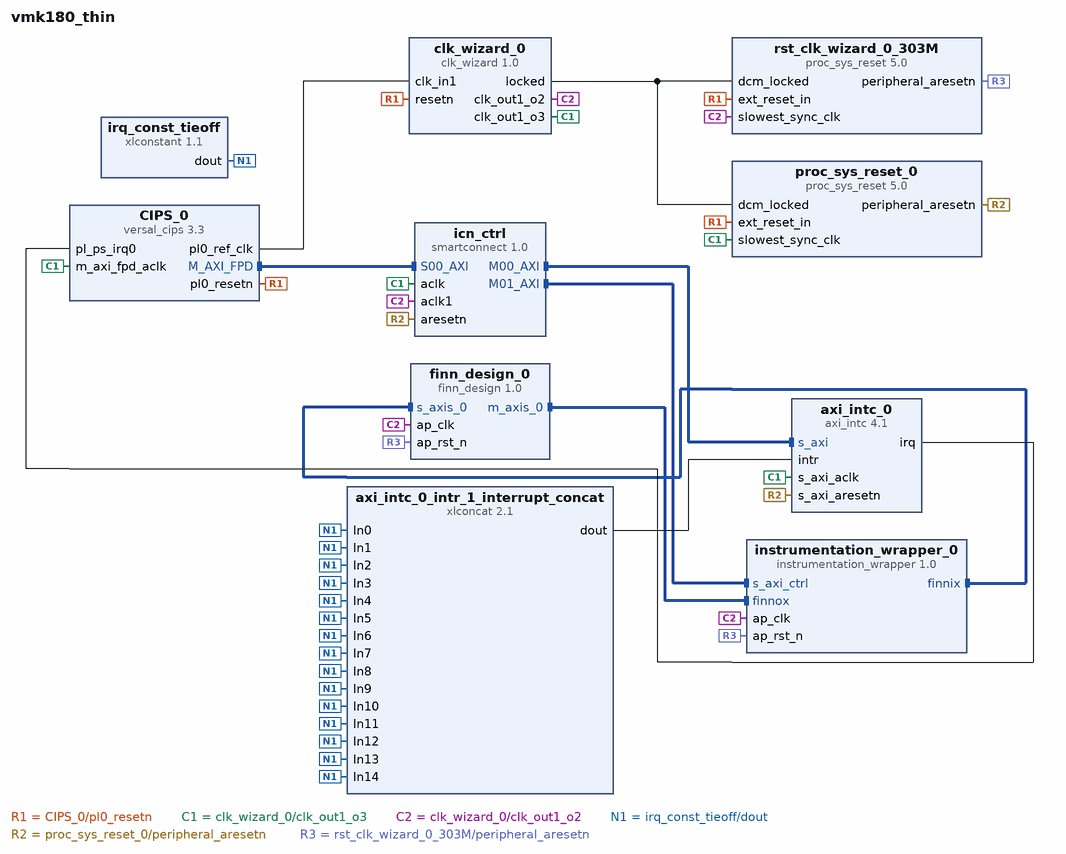
[diagram p0: block diagram of the top level]
# Vivado block design vmk180_thin, xcvm1802-vsva2197-2MP-e-S, Vivado 2022.2
create_bd_design vmk180_thin

create_bd_cell -type ip -vlnv xilinx.com:ip:versal_cips:3.3 CIPS_0
set_property -dict [list \
  CONFIG.CLOCK_MODE Custom \
  CONFIG.DDR_MEMORY_MODE Custom \
  CONFIG.PS_BOARD_INTERFACE ps_pmc_fixed_io \
  CONFIG.PS_PL_CONNECTIVITY_MODE Custom \
  CONFIG.PS_PMC_CONFIG {['CLOCK_MODE Custom', 'DDR_MEMORY_MODE Custom', 'DESIGN_MODE 1', 'PMC_CRP_PL0_REF_CTRL_FREQMHZ 99.999992', 'PMC_GPIO0_MIO_PERIPHERAL {{ENABLE 1} {IO {PMC_MIO 0 .. 25}}}', 'PMC_GPIO1_MIO_PERIPHERAL {{ENABLE 1} {IO {PMC_MIO 26 .. 51}}}', 'PMC_MIO37 {{AUX_IO 0} {DIRECTION out} {DRIVE_STRENGTH 8mA} {OUTPUT_DATA high} {PULL pullup} {SCHMITT 0} {SLEW slow} {USAGE GPIO}}', 'PMC_OSPI_PERIPHERAL {{ENABLE 0} {IO {PMC_MIO 0 .. 11}} {MODE Single}}', 'PMC_QSPI_COHERENCY 0', 'PMC_QSPI_FBCLK {{ENABLE 1} {IO {PMC_MIO 6}}}', 'PMC_QSPI_PERIPHERAL_DATA_MODE x4', 'PMC_QSPI_PERIPHERAL_ENABLE 1', 'PMC_QSPI_PERIPHERAL_MODE {Dual Parallel}', 'PMC_REF_CLK_FREQMHZ 33.3333', 'PMC_SD1 {{CD_ENABLE 1} {CD_IO {PMC_MIO 28}} {POW_ENABLE 1} {POW_IO {PMC_MIO 51}} {RESET_ENABLE 0} {RESET_IO {PMC_MIO 12}} {WP_ENABLE 0} {WP_IO {PMC_MIO 1}}}', 'PMC_SD1_COHERENCY 0', 'PMC_SD1_DATA_TRANSFER_MODE 8Bit', 'PMC_SD1_PERIPHERAL {{CLK_100_SDR_OTAP_DLY 0x3} {CLK_200_SDR_OTAP_DLY 0x2} {CLK_50_DDR_ITAP_DLY 0x36} {CLK_50_DDR_OTAP_DLY 0x3} {CLK_50_SDR_ITAP_DLY 0x2C} {CLK_50_SDR_OTAP_DLY 0x4} {ENABLE 1} {IO {PMC_MIO 26 .. 36}}}', 'PMC_SD1_SLOT_TYPE {SD 3.0}', 'PMC_USE_PMC_NOC_AXI0 0', 'PS_BOARD_INTERFACE ps_pmc_fixed_io', 'PS_CAN1_PERIPHERAL {{ENABLE 1} {IO {PMC_MIO 40 .. 41}}}', 'PS_ENET0_MDIO {{ENABLE 1} {IO {PS_MIO 24 .. 25}}}', 'PS_ENET0_PERIPHERAL {{ENABLE 1} {IO {PS_MIO 0 .. 11}}}', 'PS_ENET1_PERIPHERAL {{ENABLE 1} {IO {PS_MIO 12 .. 23}}}', 'PS_GEN_IPI0_ENABLE 1', 'PS_GEN_IPI0_MASTER A72', 'PS_GEN_IPI1_ENABLE 1', 'PS_GEN_IPI1_MASTER A72', 'PS_GEN_IPI2_ENABLE 1', 'PS_GEN_IPI2_MASTER A72', 'PS_GEN_IPI3_ENABLE 1', 'PS_GEN_IPI3_MASTER A72', 'PS_GEN_IPI4_ENABLE 1', 'PS_GEN_IPI4_MASTER A72', 'PS_GEN_IPI5_ENABLE 1', 'PS_GEN_IPI5_MASTER A72', 'PS_GEN_IPI6_ENABLE 1', 'PS_GEN_IPI6_MASTER A72', 'PS_I2C0_PERIPHERAL {{ENABLE 1} {IO {PMC_MIO 46 .. 47}}}', 'PS_I2C1_PERIPHERAL {{ENABLE 1} {IO {PMC_MIO 44 .. 45}}}', 'PS_IRQ_USAGE {{CH0 1} {CH1 0} {CH10 0} {CH11 0} {CH12 0} {CH13 0} {CH14 0} {CH15 0} {CH2 0} {CH3 0} {CH4 0} {CH5 0} {CH6 0} {CH7 0} {CH8 0} {CH9 0}}', 'PS_MIO19 {{AUX_IO 0} {DIRECTION in} {DRIVE_STRENGTH 8mA} {OUTPUT_DATA default} {PULL disable} {SCHMITT 0} {SLEW slow} {USAGE Reserved}}', 'PS_MIO21 {{AUX_IO 0} {DIRECTION in} {DRIVE_STRENGTH 8mA} {OUTPUT_DATA default} {PULL disable} {SCHMITT 0} {SLEW slow} {USAGE Reserved}}', 'PS_MIO7 {{AUX_IO 0} {DIRECTION in} {DRIVE_STRENGTH 8mA} {OUTPUT_DATA default} {PULL disable} {SCHMITT 0} {SLEW slow} {USAGE Reserved}}', 'PS_MIO9 {{AUX_IO 0} {DIRECTION in} {DRIVE_STRENGTH 8mA} {OUTPUT_DATA default} {PULL disable} {SCHMITT 0} {SLEW slow} {USAGE Reserved}}', 'PS_NUM_FABRIC_RESETS 1', 'PS_PCIE_EP_RESET1_IO None', 'PS_PCIE_EP_RESET2_IO None', 'PS_PCIE_RESET {{ENABLE 1}}', 'PS_PL_CONNECTIVITY_MODE Custom', 'PS_TTC0_PERIPHERAL_ENABLE 1', 'PS_UART0_PERIPHERAL {{ENABLE 1} {IO {PMC_MIO 42 .. 43}}}', 'PS_USB3_PERIPHERAL {{ENABLE 1} {IO {PMC_MIO 13 .. 25}}}', 'PS_USE_FPD_AXI_NOC0 0', 'PS_USE_FPD_AXI_NOC1 0', 'PS_USE_FPD_CCI_NOC 0', 'PS_USE_M_AXI_FPD 1', 'PS_USE_NOC_LPD_AXI0 0', 'PS_USE_PMCPL_CLK0 1', 'SMON_ALARMS Set_Alarms_On', 'SMON_ENABLE_TEMP_AVERAGING 0', 'SMON_TEMP_AVERAGING_SAMPLES 0']} \
  CONFIG.PS_PMC_CONFIG_APPLIED 1 \
] [get_bd_cells CIPS_0]
create_bd_cell -type ip -vlnv xilinx.com:ip:axi_intc:4.1 axi_intc_0
set_property -dict {CONFIG.C_ASYNC_INTR 0xFFFFFFFF CONFIG.C_IRQ_CONNECTION 1} [get_bd_cells axi_intc_0]
create_bd_cell -type ip -vlnv xilinx.com:ip:clk_wizard:1.0 clk_wizard_0
set_property -dict [list \
  CONFIG.CE_TYPE HARDSYNC \
  CONFIG.CLKOUT_DRIVES MBUFGCE \
  CONFIG.CLKOUT_DYN_PS None \
  CONFIG.CLKOUT_GROUPING Auto \
  CONFIG.CLKOUT_MATCHED_ROUTING false \
  CONFIG.CLKOUT_PORT clk_out1 \
  CONFIG.CLKOUT_REQUESTED_DUTY_CYCLE 50.000 \
  CONFIG.CLKOUT_REQUESTED_OUT_FREQUENCY 606.0606060606061 \
  CONFIG.CLKOUT_REQUESTED_PHASE 0.000 \
  CONFIG.CLKOUT_USED true \
  CONFIG.JITTER_SEL Min_O_Jitter \
  CONFIG.PRIM_SOURCE No_buffer \
  CONFIG.RESET_TYPE ACTIVE_LOW \
  CONFIG.USE_PHASE_ALIGNMENT true \
] [get_bd_cells clk_wizard_0]
create_bd_cell -type ip -vlnv xilinx.com:ip:proc_sys_reset:5.0 proc_sys_reset_0
create_bd_cell -type ip -vlnv xilinx.com:ip:smartconnect:1.0 icn_ctrl
set_property -dict {CONFIG.NUM_CLKS 2 CONFIG.NUM_MI 2 CONFIG.NUM_SI 1} [get_bd_cells icn_ctrl]
create_bd_cell -type ip -vlnv xilinx_finn:finn:finn_design:1.0 finn_design_0
create_bd_cell -type ip -vlnv xilinx.com:hls:instrumentation_wrapper:1.0 instrumentation_wrapper_0
create_bd_cell -type ip -vlnv xilinx.com:ip:xlconcat:2.1 axi_intc_0_intr_1_interrupt_concat
set_property -dict {CONFIG.NUM_PORTS 15} [get_bd_cells axi_intc_0_intr_1_interrupt_concat]
create_bd_cell -type ip -vlnv xilinx.com:ip:xlconstant:1.1 irq_const_tieoff
set_property -dict {CONFIG.CONST_VAL 0 CONFIG.CONST_WIDTH 1} [get_bd_cells irq_const_tieoff]
create_bd_cell -type ip -vlnv xilinx.com:ip:proc_sys_reset:5.0 rst_clk_wizard_0_303M

# ---- connections ----

connect_bd_intf_net -intf_net CIPS_0_M_AXI_GP0 [get_bd_intf_pins CIPS_0/M_AXI_FPD] [get_bd_intf_pins icn_ctrl/S00_AXI]
connect_bd_intf_net [get_bd_intf_pins finn_design_0/m_axis_0] [get_bd_intf_pins instrumentation_wrapper_0/finnox]
connect_bd_intf_net [get_bd_intf_pins axi_intc_0/s_axi] [get_bd_intf_pins icn_ctrl/M00_AXI]
connect_bd_intf_net [get_bd_intf_pins icn_ctrl/M01_AXI] [get_bd_intf_pins instrumentation_wrapper_0/s_axi_ctrl]
connect_bd_intf_net [get_bd_intf_pins instrumentation_wrapper_0/finnix] [get_bd_intf_pins finn_design_0/s_axis_0]
connect_bd_net -net CIPS_0_pl_clk0 [get_bd_pins CIPS_0/pl0_ref_clk] [get_bd_pins clk_wizard_0/clk_in1]
connect_bd_net -net CIPS_0_pl_resetn1 [get_bd_pins CIPS_0/pl0_resetn] \
  [get_bd_pins clk_wizard_0/resetn] [get_bd_pins proc_sys_reset_0/ext_reset_in] \
  [get_bd_pins rst_clk_wizard_0_303M/ext_reset_in]
connect_bd_net [get_bd_pins axi_intc_0_intr_1_interrupt_concat/dout] [get_bd_pins axi_intc_0/intr]
connect_bd_net [get_bd_pins axi_intc_0/irq] [get_bd_pins CIPS_0/pl_ps_irq0]
connect_bd_net -net clk_wizard_0_clk_out1 [get_bd_pins clk_wizard_0/clk_out1_o3] \
  [get_bd_pins axi_intc_0/s_axi_aclk] [get_bd_pins CIPS_0/m_axi_fpd_aclk] [get_bd_pins icn_ctrl/aclk] \
  [get_bd_pins proc_sys_reset_0/slowest_sync_clk]
connect_bd_net [get_bd_pins clk_wizard_0/clk_out1_o2] \
  [get_bd_pins finn_design_0/ap_clk] [get_bd_pins instrumentation_wrapper_0/ap_clk] \
  [get_bd_pins rst_clk_wizard_0_303M/slowest_sync_clk] [get_bd_pins icn_ctrl/aclk1]
connect_bd_net [get_bd_pins clk_wizard_0/locked] [get_bd_pins proc_sys_reset_0/dcm_locked] [get_bd_pins rst_clk_wizard_0_303M/dcm_locked]
connect_bd_net [get_bd_pins irq_const_tieoff/dout] \
  [get_bd_pins axi_intc_0_intr_1_interrupt_concat/In1] [get_bd_pins axi_intc_0_intr_1_interrupt_concat/In0] \
  [get_bd_pins axi_intc_0_intr_1_interrupt_concat/In2] [get_bd_pins axi_intc_0_intr_1_interrupt_concat/In3] \
  [get_bd_pins axi_intc_0_intr_1_interrupt_concat/In4] [get_bd_pins axi_intc_0_intr_1_interrupt_concat/In5] \
  [get_bd_pins axi_intc_0_intr_1_interrupt_concat/In6] [get_bd_pins axi_intc_0_intr_1_interrupt_concat/In7] \
  [get_bd_pins axi_intc_0_intr_1_interrupt_concat/In8] [get_bd_pins axi_intc_0_intr_1_interrupt_concat/In9] \
  [get_bd_pins axi_intc_0_intr_1_interrupt_concat/In10] [get_bd_pins axi_intc_0_intr_1_interrupt_concat/In11] \
  [get_bd_pins axi_intc_0_intr_1_interrupt_concat/In12] [get_bd_pins axi_intc_0_intr_1_interrupt_concat/In13] \
  [get_bd_pins axi_intc_0_intr_1_interrupt_concat/In14]
connect_bd_net [get_bd_pins proc_sys_reset_0/peripheral_aresetn] [get_bd_pins axi_intc_0/s_axi_aresetn] [get_bd_pins icn_ctrl/aresetn]
connect_bd_net [get_bd_pins rst_clk_wizard_0_303M/peripheral_aresetn] \
  [get_bd_pins finn_design_0/ap_rst_n] [get_bd_pins instrumentation_wrapper_0/ap_rst_n]
set_property PFM.CLOCK {clk_out1_o1 {id "0" is_default "true" proc_sys_reset "/proc_sys_reset_0" status "fixed" freqhz "${AP_CLK_2X_MHZ}000000" } clk_out1_o2 {id "1" is_default "false" proc_sys_reset "/proc_sys_reset_0" status "fixed" freqhz "${AP_CLK_MHZ}000000" } clk_out1_o3 {id "2" is_default "false" proc_sys_reset "/proc_sys_reset_0" status "fixed" } } [get_bd_cells clk_wizard_0]
set_property PFM.AXI_PORT {M02_AXI { memport "M_AXI_GP" sptag "" memory "" } M03_AXI { memport "M_AXI_GP" sptag "" memory "" } M04_AXI { memport "M_AXI_GP" sptag "" memory "" } M05_AXI { memport "M_AXI_GP" sptag "" memory "" } M06_AXI { memport "M_AXI_GP" sptag "" memory "" } M07_AXI { memport "M_AXI_GP" sptag "" memory "" } M08_AXI { memport "M_AXI_GP" sptag "" memory "" } M09_AXI { memport "M_AXI_GP" sptag "" memory "" } M10_AXI { memport "M_AXI_GP" sptag "" memory "" } M11_AXI { memport "M_AXI_GP" sptag "" memory "" } M12_AXI { memport "M_AXI_GP" sptag "" memory "" } M13_AXI { memport "M_AXI_GP" sptag "" memory "" } M14_AXI { memport "M_AXI_GP" sptag "" memory "" } M15_AXI { memport "M_AXI_GP" sptag "" memory "" } } [get_bd_cells icn_ctrl]
set_property HDL_ATTRIBUTE.ap_clk.FREQ_HZ 303031250 [get_bd_cells finn_design_0]
set_property HDL_ATTRIBUTE.ap_clk.FREQ_HZ_TOLERANCE 15151562 [get_bd_cells finn_design_0]
set_property HDL_ATTRIBUTE.ap_clk.refClockId 1 [get_bd_cells finn_design_0]
set_property HDL_ATTRIBUTE.ap_clk.FREQ_HZ 303031250 [get_bd_cells instrumentation_wrapper_0]
set_property HDL_ATTRIBUTE.ap_clk.FREQ_HZ_TOLERANCE 15151562 [get_bd_cells instrumentation_wrapper_0]
set_property HDL_ATTRIBUTE.ap_clk.refClockId 1 [get_bd_cells instrumentation_wrapper_0]

# ---- address map ----
assign_bd_address -offset 0x000A4000000 -range 64K -target_address_space [get_bd_addr_spaces CIPS_0/M_AXI_FPD] [get_bd_addr_segs axi_intc_0/S_AXI/Reg]
assign_bd_address -offset 0x000A4010000 -range 64K -target_address_space [get_bd_addr_spaces CIPS_0/M_AXI_FPD] [get_bd_addr_segs instrumentation_wrapper_0/s_axi_ctrl/Reg]

validate_bd_design
save_bd_design
